# EAGLE design enc_as5047p (EAGLE 9.6.2)
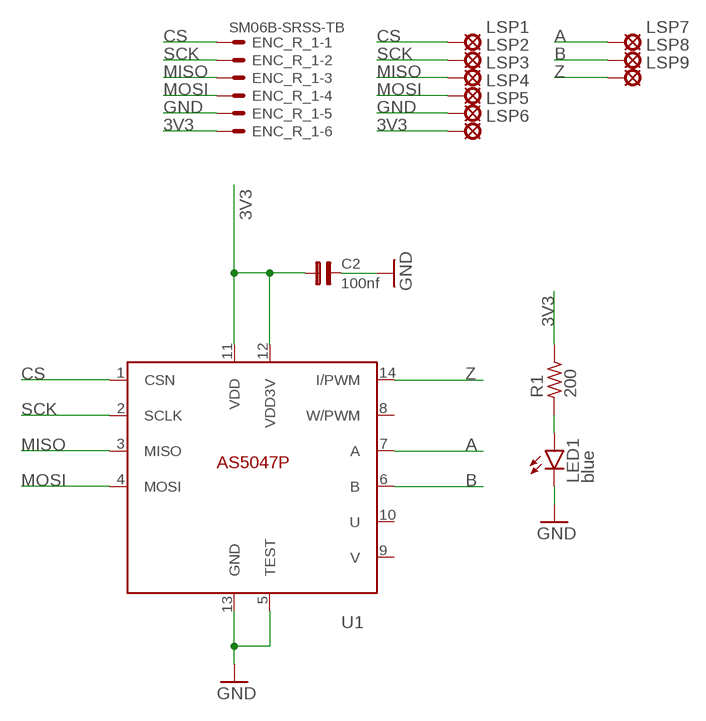
[diagram p0: schematic, sheet 1]

## Parts
C2  100nf  C0603  [0603]
ENC_R_1  SM06B-SRSS-TB  [SM06B-SRSS-TB]
LED1  blue  LEDSML0603  [SML0603]
LSP1  LSP10  [LSP10]
LSP2  LSP10  [LSP10]
LSP3  LSP10  [LSP10]
LSP4  LSP10  [LSP10]
LSP5  LSP10  [LSP10]
LSP6  LSP10  [LSP10]
LSP7  LSP10  [LSP10]
LSP8  LSP10  [LSP10]
LSP9  LSP10  [LSP10]
R1  200  R_0603  [R0603]
U1  AS5047P  [TSSOP14]

## Nets
3V3: C2.1 ENC_R_1.6 LSP6.MP R1.2 U1.11(VDD) U1.12(VDD3V)
A: LSP7.MP U1.7(A)
B: LSP8.MP U1.6(B)
CS: ENC_R_1.1 LSP1.MP U1.1(CSN)
GND: C2.2 ENC_R_1.5 LED1.C LSP5.MP U1.5(TEST) U1.13(GND)
MISO: ENC_R_1.3 LSP3.MP U1.3(MISO)
MOSI: ENC_R_1.4 LSP4.MP U1.4(MOSI)
N$2: LED1.A R1.1
SCK: ENC_R_1.2 LSP2.MP U1.2(SCLK)
Z: LSP9.MP U1.14(I/PWM)
Unconnected: U1.8(W/PWM) U1.9(V) U1.10(U)

## Library data of the parts
C2 = capsmd:C0603
ENC_R_1 = con-jst2:?M06B-SRSS-TB: Disconnectable Crimp style connector, 1.0mm pitch 6 contacts
LED1 = led:LED: LED OSRAM: - CHIPLED LG R971, LG N971, LY N971, LG Q971, LY Q971, LO R971, LY R971 LH N974, LH R974 LS Q976, LO Q976, LY Q976 LO Q996 - Hyper CHIPLED LW Q18S LB Q993, LB Q99A, LB R99A - SideLED LS A670, LO A670, LY A670, LG A670, LP A670 LB A673, LV A673, LT A673, LW A673 LH A674 LY A675 LS A676, LA A676, LO A676, LY A676, LW A676 LS A679, LY A679, LG A679 - Hyper Micro SIDELED® LS Y876, LA Y876, LO Y876, LY Y876 LT Y87S - SmartLED LW L88C, LW L88S LB L89C, LB L89S, LG L890 LS L89K, LO L89K, LY L89K LS L896, LA L896, LO L896, LY L896 - TOPLED LS T670, LO T670, LY T670, LG T670, LP T670 LSG T670, LSP T670, LSY T670, LOP T670, LYG T670 LG T671, LOG T671, LSG T671 LB T673, LV T673, LT T673, LW T673 LH T674 LS T676, LA T676, LO T676, LY T676, LB T676, LH T676, LSB T676, LW T676 LB T67C, LV T67C, LT T67C, LS T67K, LO T67K, LY T67K, LW E67C LS E67B, LA E67B, LO E67B, LY E67B, LB E67C, LV E67C, LT E67C LW T67C LS T679, LY T679, LG T679 LS T770, LO T770, LY T770, LG T770, LP T770 LB T773, LV T773, LT T773, LW T773 LH T774 LS E675, LA E675, LY E675, LS T675 LS T776, LA T776, LO T776, LY T776, LB T776 LHGB T686 LT T68C, LB T68C - Hyper Mini TOPLED® LB M676 - Mini TOPLED Santana® LG M470 LS M47K, LO M47K, LY M47K Source: http://www.osram.convergy.de LUXEON: - LUMILED® LXK2-PW12-R00, LXK2-PW12-S00, LXK2-PW14-U00, LXK2-PW14-V00 LXK2-PM12-R00, LXK2-PM12-S00, LXK2-PM14-U00 LXK2-PE12-Q00, LXK2-PE12-R00, LXK2-PE12-S00, LXK2-PE14-T00, LXK2-PE14-U00 LXK2-PB12-K00, LXK2-PB12-L00, LXK2-PB12-M00, LXK2-PB14-N00, LXK2-PB14-P00, LXK2-PB14-Q00 LXK2-PR12-L00, LXK2-PR12-M00, LXK2-PR14-Q00, LXK2-PR14-R00 LXK2-PD12-Q00, LXK2-PD12-R00, LXK2-PD12-S00 LXK2-PH12-R00, LXK2-PH12-S00 LXK2-PL12-P00, LXK2-PL12-Q00, LXK2-PL12-R00 Source: www.luxeon.com KINGBRIGHT: KA-3528ASYC Source: www.kingbright.com
LSP1-LSP9 = solpad:LSP10: SOLDER PAD drill 1.0 mm, distributor Buerklin, 12H555
R1 = rc-master-smd:R_: RESISTOR
U1 = AMS-AS5047P-encoder:AS5047P

## Board
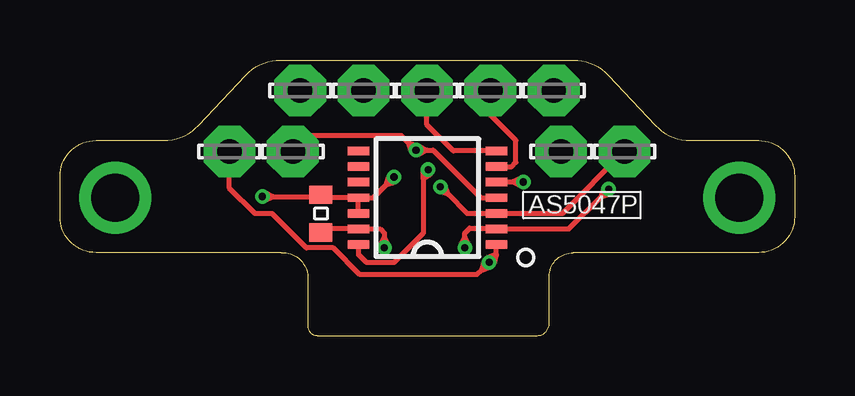
[diagram p1: board, top side]
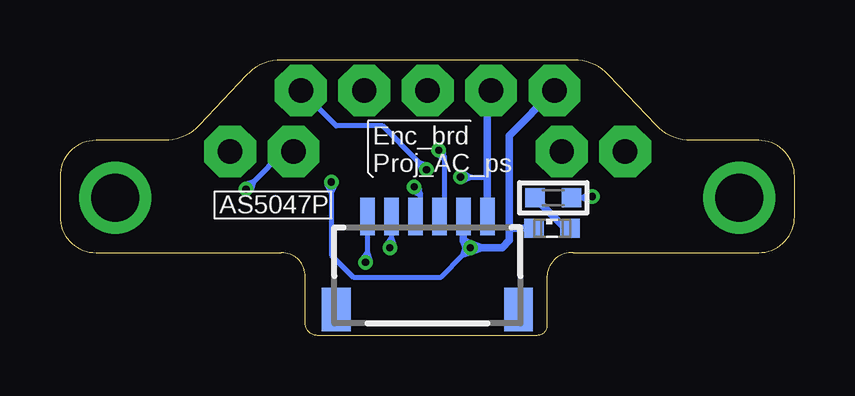
[diagram p2: board, bottom side, seen from below]

Size 30.61 x 11.48 mm. Coordinates in mm from the lower left corner, seen from the top.
Outline: 5.77,8.76 7.74,10.85 arc-47 9.2,11.48 21.38,11.48 arc-47 22.84,10.85 24.81,8.76 arc47 26.26,8.13 29.11,8.13 arc-90 30.61,6.63 30.61,4.95 arc-90 29.11,3.45 21.38,3.45 arc90 20.38,2.45 20.38,0.5 arc-90 19.88,0 10.72,0 arc-90 10.33,0.4 10.33,2.45 arc90 9.22,3.45 1.5,3.45 arc-90 0,4.95 0,6.63 arc-90 1.5,8.13 4.32,8.13 arc47 5.77,8.76
Copper layers (1*16): Top 0.035mm / dielectric 1.5mm / Bottom 0.035mm
Design rules "shuang_2layer_jlc_t1_compact": minimum track width 6mil, minimum drill 0.3mm, track to track 6mil, track to pad 6mil, pad to pad 6mil, via to via 6mil, smd to smd 6mil, copper to edge 5mil, drill to drill 6mil, minimum pad ring 6mil, minimum via ring 6mil, stop-mask expansion 4mil, vias tented up to drill 15mil, thermal gap 10mil

### Footprints (pad centres in the part's own frame; a part is rotated, then mirrored left to right if it is on the bottom)
0603 = smd 0.762 x 0.965: 1 -0.787,0; 2 0.787,0
SM06B-SRSS-TB = smd 0.6 x 1.55: 1 -2.5,2.975; 2 -1.5,2.975; 3 -0.5,2.975; 4 0.5,2.975; 5 1.5,2.975; 6 2.5,2.975 | smd 1.2 x 1.8: FIT@1 -3.8,-0.9; FIT@2 3.8,-0.9
SML0603 = smd 0.8 x 0.8: A 0.75,0; C -0.75,0
LSP10 = drill 1.016 pad 2.159 octagon: MP 0,0
R0603 = smd 0.8 x 0.8: 1 -0.762,0; 2 0.762,0
TSSOP14 = smd 0.9 x 0.35: 1 -2.875,1.95; 2 -2.875,1.3; 3 -2.875,0.65; 4 -2.875,0; 5 -2.875,-0.65; 6 -2.875,-1.3; 7 -2.875,-1.95; 8 2.875,-1.95; 9 2.875,-1.3; 10 2.875,-0.65; 11 2.875,0; 12 2.875,0.65; 13 2.875,1.3; 14 2.875,1.95

### Placement (x,y rotation side)
C2  10.87,5.08 270 top
ENC_R_1  15.3,1.98 0 bottom
LED1  10.11,4.47 0 bottom
LSP1  7.06,7.67 0 top
LSP2  20.88,7.67 0 top
LSP3  23.52,7.67 0 top
LSP4  9.7,7.67 0 top
LSP5  10.01,10.21 0 top
LSP6  12.65,10.21 0 top
LSP7  15.29,10.21 0 top
LSP8  17.93,10.21 0 top
LSP9  20.57,10.21 0 top
R1  10.06,5.74 0 bottom
U1  15.3,5.74 180 top

### Tracks (layer width: path | path; a pad name or v marks a point on that pad's centre or on a via)
3V3  (via drill 0.3)
  Top 0.203: U1.12 U1.11 | U1.11 13.06,5.74 13.6,6.29 | 13.6,6.29 v13.92,6.6 | U1.11 11,5.74 C2.1 10.79,5.79 8.88,5.79 | v8.43,5.79 8.88,5.79 | 13.6,6.29 13.98,6.41 v13.92,6.6 | 13.6,6.29 13.73,6.67 v13.92,6.6 | 8.88,5.79 8.52,5.97 v8.43,5.79 | 8.88,5.79 8.52,5.61 v8.43,5.79
  Bottom 0.203: v13.92,6.6 13.47,6.6 | 13.47,6.6 12.8,6.6 | R1.2 8.88,5.74 | 8.88,5.74 8.48,5.74 v8.43,5.79 | 13.47,6.6 13.83,6.42 v13.92,6.6 | 13.47,6.6 13.83,6.78 v13.92,6.6 | 8.88,5.74 8.54,5.96 v8.43,5.79 | 8.88,5.74 8.5,5.6 v8.43,5.79
  Bottom 0.305: ENC_R_1.6 12.8,6.6 12.8,10.06 LSP6.MP
A
  Top 0.203: U1.7 16.39,7.69 15.29,8.79 LSP7.MP
B
  Top 0.203: U1.6 18.83,7.04 19,7.21 19,8.13 17.93,9.2 LSP8.MP
CS  (via drill 0.3)
  Top 0.203: v17.88,3.05 18.18,3.35 18.18,3.39 | 18.18,3.39 U1.1 | v17.88,3.05 17.56,2.73 | 17.56,2.73 17.37,2.54 12.5,2.54 11.38,3.66 10.26,3.66 8.84,5.08 8.13,5.08 7.06,6.15 LSP1.MP | 18.18,3.39 17.81,3.23 v17.88,3.05 | 18.18,3.39 18.08,3 v17.88,3.05 | 17.56,2.73 17.95,2.86 v17.88,3.05 | 17.56,2.73 17.69,3.11 v17.88,3.05
  Bottom 0.203: ENC_R_1.1 17.8,3.49 | 17.8,3.49 17.8,3.13 v17.88,3.05 | 17.8,3.49 17.69,3.11 v17.88,3.05 | 17.8,3.49 18.04,3.17 v17.88,3.05
GND  (via drill 0.3)
  Top 0.203: 13.51,4.11 13.51,4.27 13.34,4.44 U1.13 11.02,4.44 C2.2 | 13.51,4.11 v13.51,3.66 | U1.5 18.85,6.4 | 18.85,6.4 v19.3,6.4 | 13.51,4.11 13.33,3.75 v13.51,3.66 | 13.51,4.11 13.69,3.75 v13.51,3.66 | 18.85,6.4 19.21,6.22 v19.3,6.4 | 18.85,6.4 19.21,6.58 v19.3,6.4
  Bottom 0.203: v19.3,6.4 19.3,5.95 | 19.3,5.95 19.3,3.35 18.39,2.44 14.73,2.44 13.83,3.34 | 13.83,3.34 v13.51,3.66 | 13.83,3.34 13.7,3.72 v13.51,3.66 | 13.83,3.34 13.45,3.47 v13.51,3.66 | 19.3,5.95 19.48,6.31 v19.3,6.4 | 19.3,5.95 19.12,6.31 v19.3,6.4
  Bottom 0.305: ENC_R_1.5 13.8,4 | 13.8,4 13.8,3.95 v13.51,3.66 | v13.51,3.66 13.06,3.66 | 13.06,3.66 12.19,3.66 11.89,3.96 11.89,4.47 | LSP5.MP 11.89,8.33 11.89,4.47 | LED1.C 11.89,4.47 | 13.8,4 13.44,3.79 v13.51,3.66 | 13.8,4 13.65,3.6 v13.51,3.66 | 13.06,3.66 13.46,3.52 v13.51,3.66 | 13.06,3.66 13.46,3.8 v13.51,3.66
MISO  (via drill 0.3)
  Top 0.203: v15.85,6.2 16.17,5.88 | 16.17,5.88 16.95,5.09 U1.3 20.94,5.09 LSP3.MP | 16.17,5.88 16.04,6.26 v15.85,6.2 | 16.17,5.88 15.79,6.01 v15.85,6.2
  Bottom 0.203: ENC_R_1.3 15.6,5.16 15.6,5.82 | 15.6,5.82 15.6,5.95 v15.85,6.2 | 15.6,5.82 15.95,6.02 v15.85,6.2 | 15.6,5.82 15.65,6.22 v15.85,6.2
MOSI  (via drill 0.3)
  Top 0.203: v14.83,7.72 15.28,7.72 | 15.28,7.72 15.54,7.72 17.52,5.74 U1.4 | LSP4.MP 10.36,8.33 14.22,8.33 14.52,8.04 | v14.83,7.72 14.52,8.04 | 15.28,7.72 14.92,7.9 v14.83,7.72 | 15.28,7.72 14.92,7.54 v14.83,7.72 | 14.52,8.04 14.64,7.66 v14.83,7.72 | 14.52,8.04 14.9,7.91 v14.83,7.72
  Bottom 0.203: 14.6,7.34 14.6,7.49 v14.83,7.72 | 14.6,7.34 14.6,5.16 ENC_R_1.4 | 14.6,7.34 14.94,7.55 v14.83,7.72 | 14.6,7.34 14.63,7.74 v14.83,7.72
N$1  (via drill 2)
  other vias: 2.3,5.74
N$2
  Bottom 0.305: R1.1 9.55,4.47 LED1.A
N$3  (via drill 2)
  other vias: 28.3,5.74
SCK  (via drill 0.3)
  Top 0.203: v16.87,3.66 16.87,4.11 | 16.87,4.11 16.87,4.27 17.07,4.47 18.15,4.47 U1.2 21.21,4.44 22.54,5.78 | 22.54,5.78 v22.86,6.1 | 16.87,4.11 16.69,3.75 v16.87,3.66 | 16.87,4.11 17.05,3.75 v16.87,3.66 | 22.54,5.78 22.92,5.91 v22.86,6.1 | 22.54,5.78 22.67,6.16 v22.86,6.1
  Bottom 0.203: ENC_R_1.2 16.8,4.1 | 16.8,4.1 16.8,3.72 v16.87,3.66 | v22.86,6.1 22.54,6.41 | 22.54,6.41 21.28,7.67 LSP2.MP | 16.8,4.1 16.68,3.72 v16.87,3.66 | 16.8,4.1 17.03,3.77 v16.87,3.66 | 22.54,6.41 22.67,6.03 v22.86,6.1 | 22.54,6.41 22.92,6.29 v22.86,6.1
Z  (via drill 0.3)
  Top 0.203: U1.14 12.43,3.39 12.77,3.05 13.92,3.05 15.14,4.27 15.14,6.51 | v15.34,6.91 15.14,6.71 15.14,6.51 | 15.14,6.51 15.46,6.75 v15.34,6.91 | 15.14,6.51 15.14,6.91 v15.34,6.91
  Bottom 0.203: v15.34,6.91 15.66,7.23 | 15.66,7.23 17.17,8.74 19.1,8.74 LSP9.MP | 15.66,7.23 15.28,7.1 v15.34,6.91 | 15.66,7.23 15.53,6.85 v15.34,6.91

### Text on the board
tPlace: AS5047P
bPlace: Enc_brd / Proj_AC_ps | AS5047P